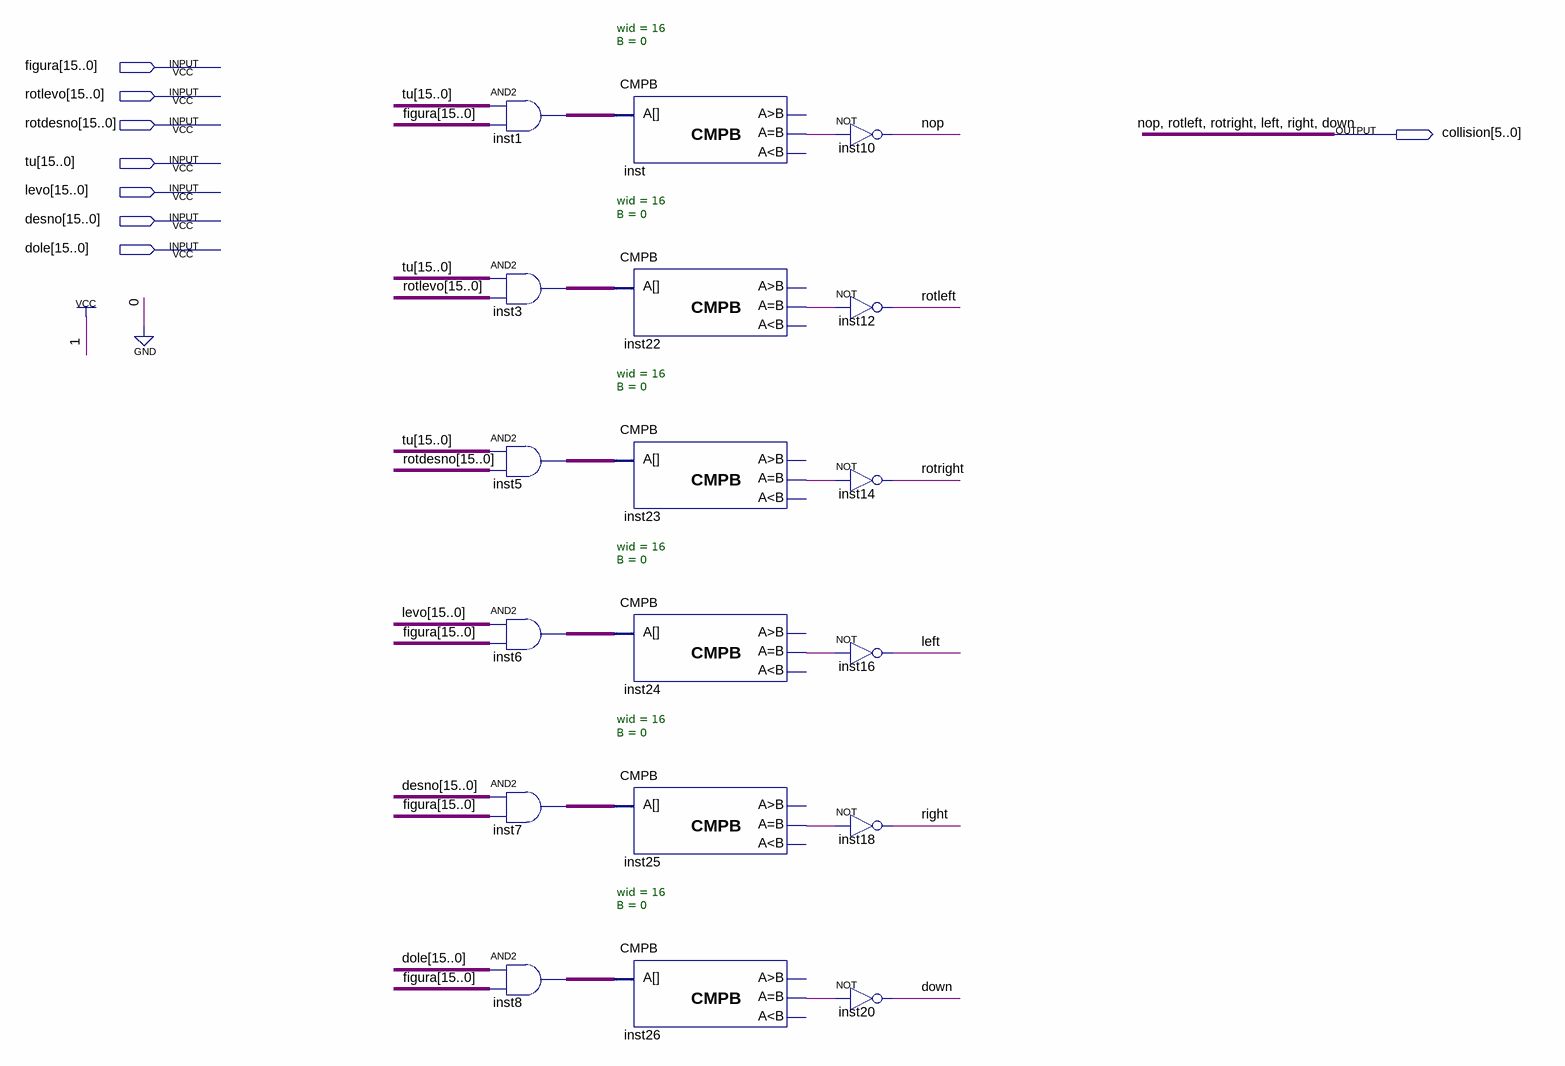
[diagram p0: schematic sheet]
// Quartus schematic utvrdjivanje.bdf as structural Verilog: 18 symbols, 8 pins
module utvrdjivanje (
  input  [15:0] figura,
  input  [15:0] rotlevo,
  input  [15:0] rotdesno,
  input  [15:0] tu,
  input  [15:0] levo,
  input  [15:0] desno,
  input  [15:0] dole,
  output [5:0] collision
);

  wire inst22_eq, inst23_eq, inst24_eq, inst25_eq, inst26_eq, inst_eq;
  wire [15:0] inst1_out, inst3_out, inst5_out, inst6_out, inst7_out, inst8_out;

  assign inst1_out = tu & figura;  // AND2 inst1, 16 bits wide
  assign inst3_out = tu & rotlevo;  // AND2 inst3, 16 bits wide
  assign inst5_out = tu & rotdesno;  // AND2 inst5, 16 bits wide
  assign inst6_out = levo & figura;  // AND2 inst6, 16 bits wide
  assign inst7_out = desno & figura;  // AND2 inst7, 16 bits wide
  assign inst8_out = dole & figura;  // AND2 inst8, 16 bits wide
  CMPB #(.wid(16), .B(0)) inst (.A(inst1_out), .eq(inst_eq));  // open: gr, ls
  CMPB #(.wid(16), .B(0)) inst22 (.A(inst3_out), .eq(inst22_eq));  // open: gr, ls
  CMPB #(.wid(16), .B(0)) inst23 (.A(inst5_out), .eq(inst23_eq));  // open: gr, ls
  CMPB #(.wid(16), .B(0)) inst24 (.A(inst6_out), .eq(inst24_eq));  // open: gr, ls
  CMPB #(.wid(16), .B(0)) inst25 (.A(inst7_out), .eq(inst25_eq));  // open: gr, ls
  CMPB #(.wid(16), .B(0)) inst26 (.A(inst8_out), .eq(inst26_eq));  // open: gr, ls
  not inst10 (collision[5], inst_eq);
  not inst12 (collision[4], inst22_eq);
  not inst14 (collision[3], inst23_eq);
  not inst16 (collision[2], inst24_eq);
  not inst18 (collision[1], inst25_eq);
  not inst20 (collision[0], inst26_eq);

  // Other names for the same wires on the sheet: down = collision[0]; left = collision[2]; nop = collision[5];
  //   right = collision[1]; rotleft = collision[4]; rotright = collision[3]
endmodule
